# Altium schematic sheet Misc.SchDoc
size A; SheetNumber: 5; SheetTotal: 5
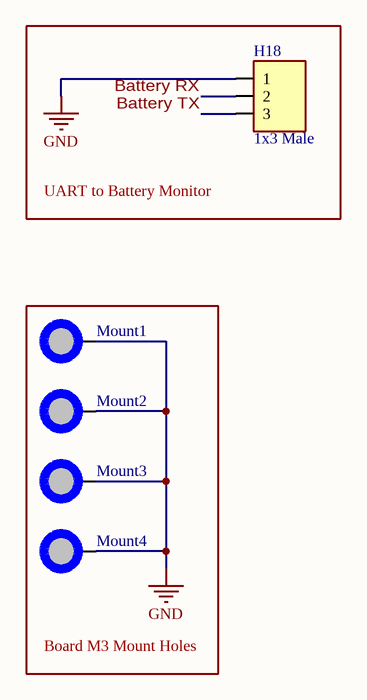
[diagram p0: Misc.SchDoc]

## Parts
H18  1x3 Male  [[Header] Shrouded 1x3 Male]
Mount1  M3 Mount Hole  [[Mount] M3 Mount Hole]  (value not drawn)  (no BOM)
Mount2  M3 Mount Hole  [[Mount] M3 Mount Hole]  (value not drawn)  (no BOM)
Mount3  M3 Mount Hole  [[Mount] M3 Mount Hole]  (value not drawn)  (no BOM)
Mount4  M3 Mount Hole  [[Mount] M3 Mount Hole]  (value not drawn)  (no BOM)

## Blocks framed on the sheet
UART to Battery Monitor: H18
Board M3 Mount Holes: Mount1-Mount4

## Nets
GND: H18.1 Mount1.1 Mount2.1 Mount3.1 Mount4.1
Battery RX: H18.2
Battery TX: H18.3

## Library data of the parts
H18 = [Header] Shrouded 1x3 Male: 070543-0037 / Mates with 005057-9403; Supplier 1: DigiKey; Supplier Part Number 1: WM4825-ND
Mount1-Mount4 = [Mount] M3 Mount Hole: Place at least 4.5mm from board edge. Plated.